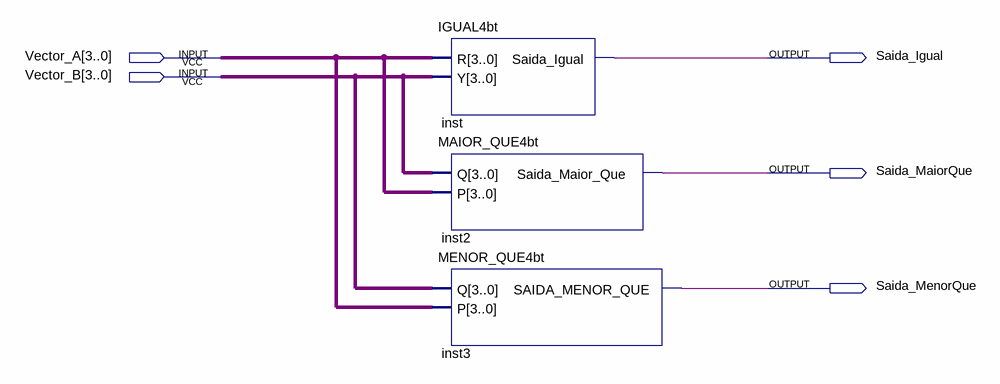
[diagram p0: schematic sheet]
// Quartus schematic FuncoesBoolean.bdf as structural Verilog: 3 symbols, 5 pins
module FuncoesBoolean (
  input  [3:0] Vector_A,
  input  [3:0] Vector_B,
  output Saida_Igual,
  output Saida_MaiorQue,
  output Saida_MenorQue
);

  IGUAL4bt inst (.R(Vector_A), .Y(Vector_B), .Saida_Igual(Saida_Igual));
  MAIOR_QUE4bt inst2 (.Q(Vector_B), .P(Vector_A), .Saida_Maior_Que(Saida_MaiorQue));
  MENOR_QUE4bt inst3 (.Q(Vector_B), .P(Vector_A), .SAIDA_MENOR_QUE(Saida_MenorQue));
endmodule
